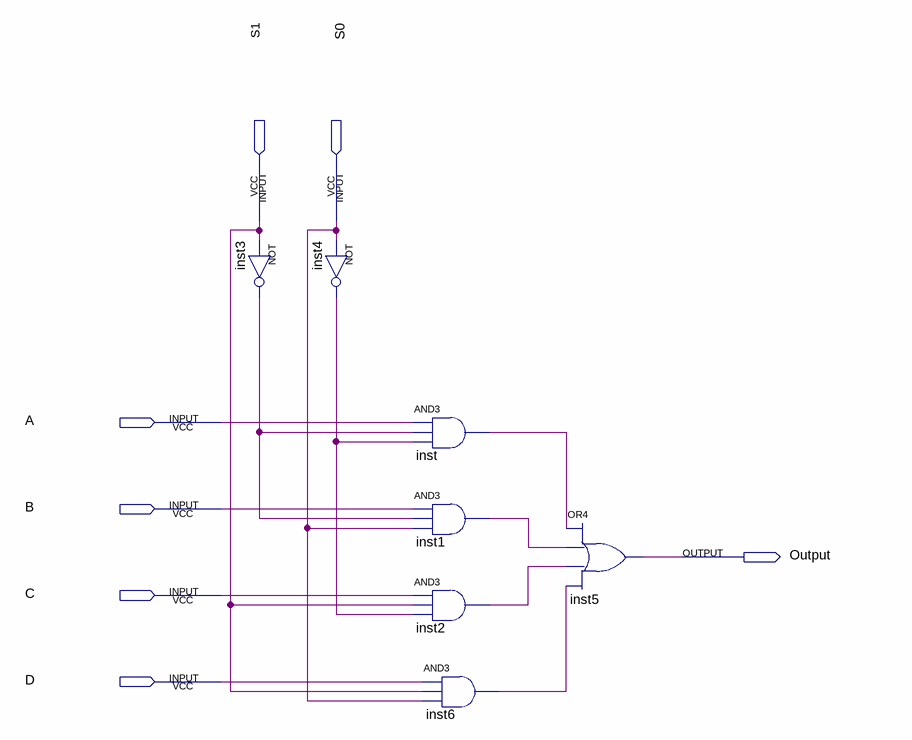
[diagram p0: schematic sheet]
// Quartus schematic fouronemux.bdf as structural Verilog: 7 symbols, 7 pins
module fouronemux (
  input  S1,
  input  S0,
  input  A,
  input  B,
  input  C,
  input  D,
  output Output
);

  wire inst1_out, inst2_out, inst3_out, inst4_out, inst6_out, inst_out;

  not inst3 (inst3_out, S1);
  not inst4 (inst4_out, S0);
  and inst (inst_out, A, inst3_out, inst4_out);
  and inst1 (inst1_out, B, inst3_out, S0);
  and inst2 (inst2_out, C, S1, inst4_out);
  and inst6 (inst6_out, D, S1, S0);
  or inst5 (Output, inst_out, inst1_out, inst2_out, inst6_out);
endmodule
